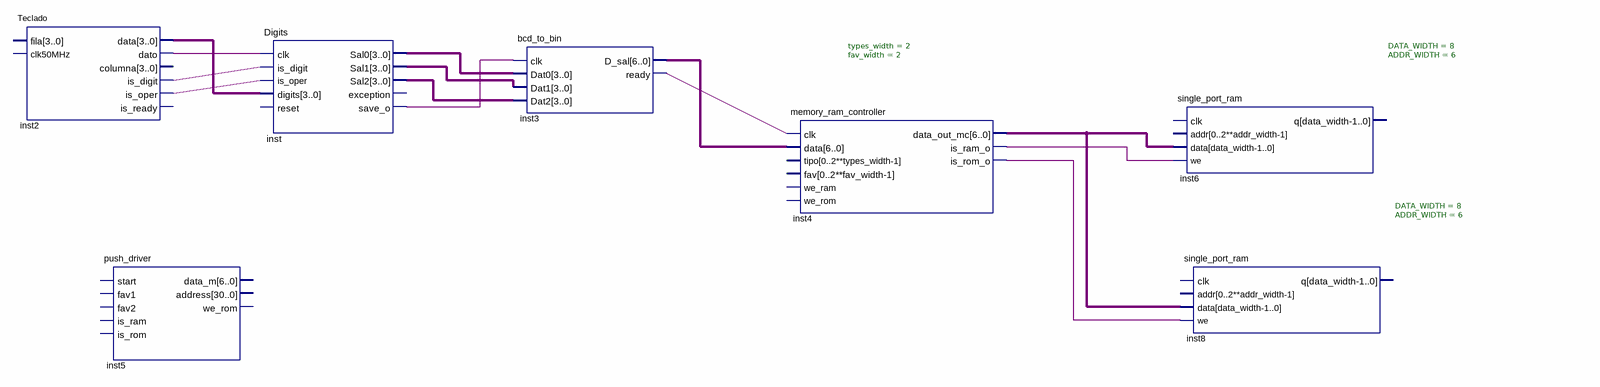
[diagram p0: schematic sheet]
// Quartus schematic Prueba1.bdf as structural Verilog: 7 symbols, 0 pins
module Prueba1 (
);

  wire inst2_dato, inst2_is_digit, inst2_is_oper, inst3_ready, inst4_is_ram_o, inst4_is_rom_o, inst_save_o;
  wire [3:0] inst2_data, inst_sal0, inst_sal1, inst_sal2;
  wire [6:0] inst3_d_sal;
  wire [7:0] inst4_data_out_mc;

  Teclado inst2 (
    .data(inst2_data), .dato(inst2_dato), .is_digit(inst2_is_digit), .is_oper(inst2_is_oper));  // open: fila, clk50MHz, columna, is_ready
  push_driver inst5 ();  // open: start, fav1, fav2, is_ram, is_rom, data_m, address, we_rom
  Digits inst (
    .clk(inst2_dato), .is_digit(inst2_is_digit), .is_oper(inst2_is_oper), .digits(inst2_data),
    .Sal0(inst_sal0), .Sal1(inst_sal1), .Sal2(inst_sal2), .save_o(inst_save_o));  // open: reset, exception
  bcd_to_bin inst3 (
    .clk(inst_save_o), .Dat0(inst_sal0), .Dat1(inst_sal1), .Dat2(inst_sal2), .D_sal(inst3_d_sal),
    .ready(inst3_ready));
  memory_ram_controller #(.types_width(2), .fav_width(2)) inst4 (
    .clk(inst3_ready), .data(inst3_d_sal), .data_out_mc(inst4_data_out_mc), .is_ram_o(inst4_is_ram_o),
    .is_rom_o(inst4_is_rom_o));  // open: tipo, fav, we_ram, we_rom
  single_port_ram #(.DATA_WIDTH(8), .ADDR_WIDTH(6)) inst6 (
    .data(inst4_data_out_mc), .we(inst4_is_ram_o));  // open: clk, addr, q
  single_port_ram #(.DATA_WIDTH(8), .ADDR_WIDTH(6)) inst8 (
    .data(inst4_data_out_mc), .we(inst4_is_rom_o));  // open: clk, addr, q
endmodule
